# EAGLE schematic Homefi_ax - HW - INT (EAGLE 7.1.0)
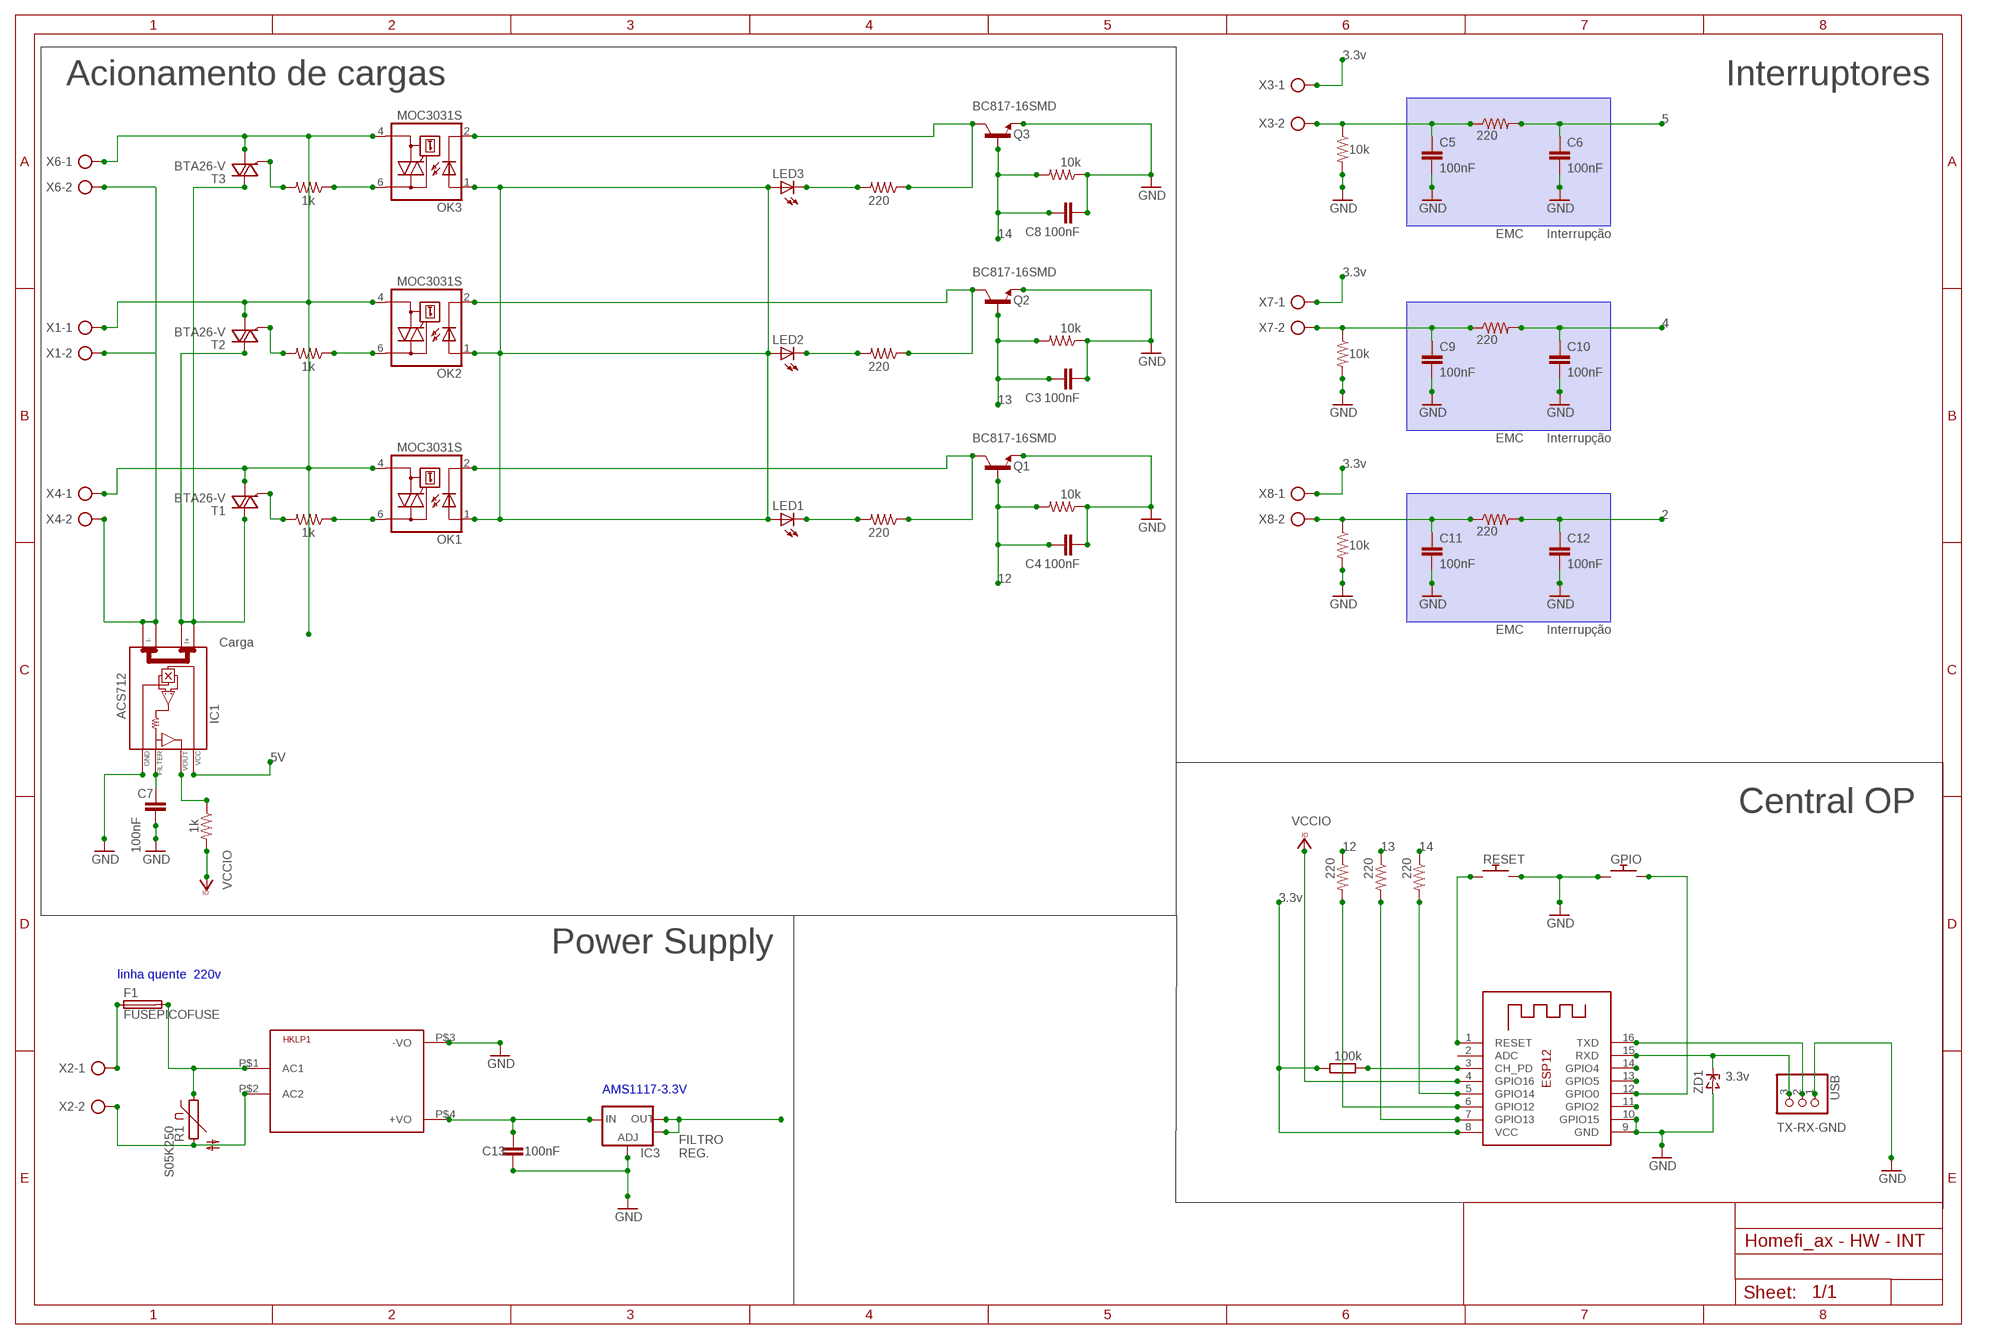
[diagram p0: schematic, sheet 1]

## Parts
1  10k  R-US_M0805  [M0805]
2  10k  R-US_M0805  [M0805]
3  100k  R-EU_M0805  [M0805]
4  1k  R-US_M0805  [M0805]
5  220  R-US_M0805  [M0805]
6  220  R-US_M0805  [M0805]
7  220  R-US_M0805  [M0805]
8  1k  R-US_M0805  [M0805]
9  10k  R-US_M0805  [M0805]
10  220  R-US_M0805  [M0805]
11  10k  R-US_M0805  [M0805]
12  220  R-US_M0805  [M0805]
13  220  R-US_M0805  [M0805]
14  220  R-US_M0805  [M0805]
15  10k  R-US_M0805  [M0805]
16  220  R-US_M0805  [M0805]
17  10k  R-US_M0805  [M0805]
18  220  R-US_M0805  [M0805]
19  1k  R-US_M0805  [M0805]
20  1k  R-US_M0805  [M0805]
C3  100nF  C-EUC0805  [C0805]
C4  100nF  C-EUC0805  [C0805]
C5  100nF  C-EUC0805  [C0805]
C6  100nF  C-EUC0805  [C0805]
C7  100nF  C-EUC0805  [C0805]
C8  100nF  C-EUC0805  [C0805]
C9  100nF  C-EUC0805  [C0805]
C10  100nF  C-EUC0805  [C0805]
C11  100nF  C-EUC0805  [C0805]
C12  100nF  C-EUC0805  [C0805]
C13  100nF  C-EUC0805  [C0805]
F1  FUSEPICOFUSE  [PICOFUSE]
GPIO  GPIO  SWITCH_PUSHBUTTONEVQ-PE  [TACT_PANA-EVQ]
HKLP1  HKLPM01  [HKLPM01]
IC1  ACS712  [SO08]
IC3  V_REG_LM1117SOT223  [SOT223]
LED1  LEDCHIPLED_0805  [CHIPLED_0805]
LED2  LEDCHIPLED_0805  [CHIPLED_0805]
LED3  LEDCHIPLED_0805  [CHIPLED_0805]
OK1  MOC3031S  [DIL6-SMD]
OK2  MOC3031S  [DIL6-SMD]
OK3  MOC3031S  [DIL6-SMD]
Q1  BC817-16SMD  [SOT23-BEC]
Q2  BC817-16SMD  [SOT23-BEC]
Q3  BC817-16SMD  [SOT23-BEC]
R1  S05K250  [S05K250]
RESET  RESET  SWITCH_PUSHBUTTONEVQ-PE  [TACT_PANA-EVQ]
T1  BTA26-V  [TOP3S-1]
T2  BTA26-V  [TOP3S-1]
T3  BTA26-V  [TOP3S-1]
USB  PINHD-1X3  [1X03]
X1  AK500/2  [AK500/2]
X2  AK500/2  [AK500/2]
X3  AK500/2  [AK500/2]
X4  AK500/2  [AK500/2]
X5  ESP-12  [ESP-12]
X6  AK500/2  [AK500/2]
X7  AK500/2  [AK500/2]
X8  AK500/2  [AK500/2]
ZD1  ZENERSOD-123  [SOD-123]

## Nets
2: 18.2 C12.1 X5.11(GPIO2)
2N1: 10.1 OK2.2(C) Q2.C
2N2: 12.1 OK3.2(C) Q3.C
2N3904: 5.1 OK1.2(C) Q1.C
3.3V: 3.2 IC3.2(OUT) IC3.4(OUT) X3.1 X5.8(VCC) X7.1 X8.1
4: 16.2 C10.1 X5.14(GPIO4)
5: 6.2 C6.1 X5.13(GPIO5)
5V: C13.2 HKLP1.P$4(+VO) IC1.8(VCC) IC3.3(IN) LED1.A LED2.A LED3.A OK1.1(A) OK2.1(A) OK3.1(A)
12: 1.2 7.1 C4.1 Q1.B
13: 9.2 13.1 C3.1 Q2.B
14: 11.2 14.1 C8.1 Q3.B
220V: F1.2 HKLP1.P$1(AC1) OK1.4(A1) OK2.4(A1) OK3.4(A1) R1.1 T1.A1 T2.A1 T3.A1 X1.1 X4.1 X6.1
220V2: F1.1 X2.1
GND: 1.1 2.2 9.1 11.1 15.2 17.2 C3.2 C4.2 C5.2 C6.2 C7.1 C8.2 C9.2 C10.2 C11.2 C12.2 C13.1 GPIO.P$1 HKLP1.P$3(-VO) IC1.5(GND) IC3.1(ADJ) Q1.E Q2.E Q3.E RESET.P$2 USB.1 X5.9(GND) X5.10(GPIO15) ZD1.A
N$1: 13.2 X5.7(GPIO13)
N$2: 14.2 X5.5(GPIO14)
N$3: 5.2 LED1.C
N$5: 20.1 OK1.6(A2)
N$9: RESET.P$1 X5.1(RESET)
N$10: C7.2 IC1.6(FILTER)
N$11: 8.1 IC1.7(VOUT)
N$12: USB.3 X5.15(RXD) ZD1.C
N$15: GPIO.P$2 X5.12(GPIO0)
N$16: 19.1 OK2.6(A2)
N$17: 4.1 OK3.6(A2)
N$18: 10.2 LED2.C
N$19: IC1.3(I-_0) IC1.4(I-_1) X1.2 X4.2 X6.2
N$21: 15.1 16.1 C9.1 X7.2
N$23: 2.1 6.1 C5.1 X3.2
N$24: 3.1 X5.3(CH_PD)
N$25: 7.2 X5.6(GPIO12)
N$35: HKLP1.P$2(AC2) R1.2 X2.2
N$36: 12.2 LED3.C
N$40: 17.1 18.1 C11.1 X8.2
N$48: USB.2 X5.16(TXD)
N$49: 20.2 T1.G
N$50: 19.2 T2.G
N$51: 4.2 T3.G
N$55: IC1.1(I+_0) IC1.2(I+_1) T1.A2 T2.A2 T3.A2
VCCIO: 8.2 X5.4(GPIO16)
Unconnected: X5.2(ADC)

## Notes on the sheet
- 3.3v
- Acionamento de cargas | Interruptores
- 5
- 14 | EMC | Interrupção
- 3.3v
- 4
- 13
- EMC | Interrupção
- 3.3v
- 2
- 12
- EMC | Interrupção
- Carga
- 5V
- Central OP
- 12 | 13 | 14
- 3.3v
- Power Supply
- linha quente  220v
- 3.3v
- AMS1117-3.3V
- TX-RX-GND
- FILTRO
  REG.

## Library data of the parts
1 2 4-20 = adafruit:R-US_: RESISTOR, American symbol
3 = rcl:R-EU_: RESISTOR, European symbol
C3-C13 = rcl:C-EU: CAPACITOR, European symbol
F1 = fuse:FUSE: Fuse; OC_FARNELL: unknown; OC_NEWARK: unknown
GPIO RESET = adafruit:SWITCH_PUSHBUTTON: Buttons SOFTTOUCHSMD_SJ - Soft touch temporary push button (Super Junk Akihabara) Compatible with SKPMANE010 [Mouser: 688-SKPMAN] C&K_KSS = Digikey: KSS221GLFS
HKLP1 = HKLPM01:HKLPM01
IC1 = ACS712:ACS712
IC3 = SparkFun-PowerIC:V_REG_LM1117: Voltage Regulator LM1117 Standard adjustable voltage regulator but in SMD form. Spark Fun Electronics SKU : COM-00595
LED1-LED3 = adafruit:LED: LED OSRAM: - CHIPLED LG R971, LG N971, LY N971, LG Q971, LY Q971, LO R971, LY R971 LH N974, LH R974 LS Q976, LO Q976, LY Q976 LO Q996 - Hyper CHIPLED LW Q18S LB Q993, LB Q99A, LB R99A - SideLED LS A670, LO A670, LY A670, LG A670, LP A670 LB A673, LV A673, LT A673, LW A673 LH A674 LY A675 LS A676, LA A676, LO A676, LY A676, LW A676 LS A679, LY A679, LG A679 - Hyper Micro SIDELED® LS Y876, LA Y876, LO Y876, LY Y876 LT Y87S - SmartLED LW L88C, LW L88S LB L89C, LB L89S, LG L890 LS L89K, LO L89K, LY L89K LS L896, LA L896, LO L896, LY L896 - TOPLED LS T670, LO T670, LY T670, LG T670, LP T670 LSG T670, LSP T670, LSY T670, LOP T670, LYG T670 LG T671, LOG T671, LSG T671 LB T673, LV T673, LT T673, LW T673 LH T674 LS T676, LA T676, LO T676, LY T676, LB T676, LH T676, LSB T676, LW T676 LB T67C, LV T67C, LT T67C, LS T67K, LO T67K, LY T67K, LW E67C LS E67B, LA E67B, LO E67B, LY E67B, LB E67C, LV E67C, LT E67C LW T67C LS T679, LY T679, LG T679 LS T770, LO T770, LY T770, LG T770, LP T770 LB T773, LV T773, LT T773, LW T773 LH T774 LS E675, LA E675, LY E675, LS T675 LS T776, LA T776, LO T776, LY T776, LB T776 LHGB T686 LT T68C, LB T68C - Hyper Mini TOPLED® LB M676 - Mini TOPLED Santana® LG M470 LS M47K, LO M47K, LY M47K Source: http://www.osram.convergy.de/
OK1-OK3 = optocoupler:MOC30*: 6-Pin DIP Zero-Cross Optoisolators Triac Driver Output (250/400 Volt Peak) Source: Data sheet <http://www.fairchildsemi.com/ds/MO/MOC3031M.pdf> The old path of data sheet not more available 2013-05-06.; MF: FAIRCHILD SEMICONDUCTOR; MPN: MOC3031SM; OC_FARNELL: unknown; OC_NEWARK: 34C1335
Q1-Q3 = transistor-npn:BC817*: NPN Transistor
R1 = varistor:S05K250: VARISTOR
T1-T3 = triac:BTA26: 25A TRIAC Source: http://www.st.com/stonline/products/literature/ds/7470.pdf
USB = adafruit:PINHD-1X3: PIN HEADER
X1-X4 X6-X8 = con-ptr500:AK500/2: CONNECTOR; OC_FARNELL: unknown; OC_NEWARK: unknown
X5 = adafruit:ESP-12
ZD1 = dp_devices:ZENER: Zener Diode SOD-323